# EAGLE design tappytap (EAGLE 7.3.0)
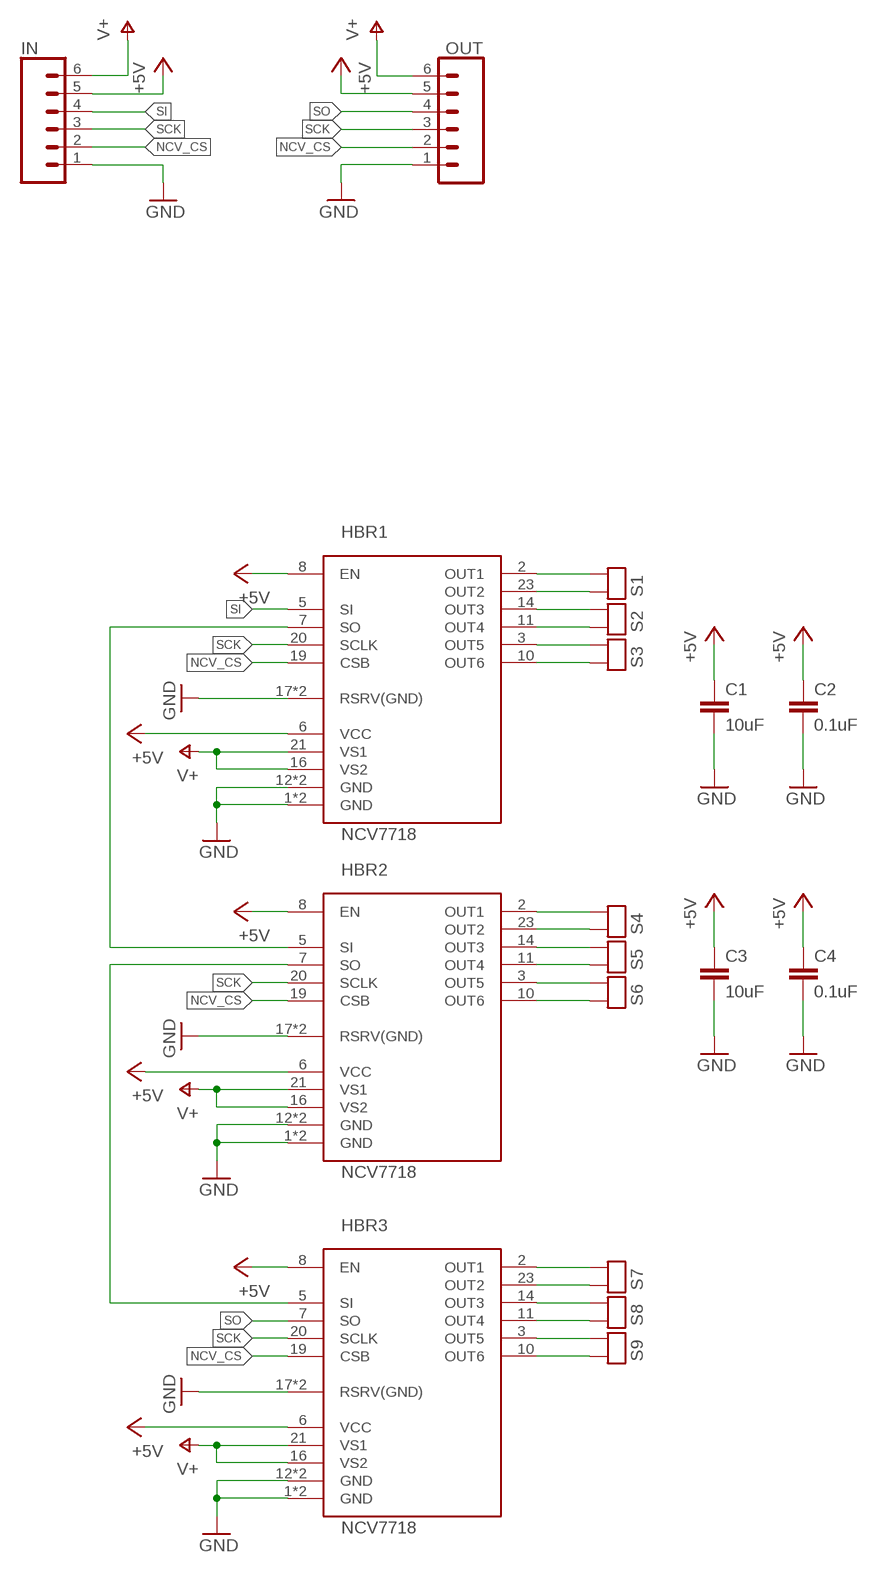
[diagram p0: schematic, sheet 1]

## Parts
C1  10uF  C-EUC0603  [C0603]
C2  0.1uF  C-EUC0603  [C0603]
C3  10uF  C-EUC0603  [C0603]
C4  0.1uF  C-EUC0603  [C0603]
HBR1  NCV7718  [SSOP-24]
HBR2  NCV7718  [SSOP-24]
HBR3  NCV7718  [SSOP-24]
IN  CONN_06SILK_FEMALE_PTH  [1X06]
OUT  CONN_06SILK_FEMALE_PTH  [1X06]
S1  TP2  [TP2_2MM]
S2  TP2  [TP2_2MM]
S3  TP2  [TP2_2MM]
S4  TP2  [TP2_2MM]
S5  TP2  [TP2_2MM]
S6  TP2  [TP2_2MM]
S7  TP2  [TP2_2MM]
S8  TP2  [TP2_2MM]
S9  TP2  [TP2_2MM]

## Nets
+5V [usbvcc]: C1.1 C2.1 C3.1 C4.1 HBR1.6(VCC) HBR1.8(EN) HBR2.6(VCC) HBR2.8(EN) HBR3.6(VCC) HBR3.8(EN) IN.5 OUT.5
GND [gnd]: C1.2 C2.2 C3.2 C4.2 HBR1.1(GND) HBR1.12(GND) HBR1.13(GND) HBR1.17(RSRV(GND)) HBR1.18(RSRV(GND)) HBR1.24(GND) HBR2.1(GND) HBR2.12(GND) HBR2.13(GND) HBR2.17(RSRV(GND)) HBR2.18(RSRV(GND)) HBR2.24(GND) HBR3.1(GND) HBR3.12(GND) HBR3.13(GND) HBR3.17(RSRV(GND)) HBR3.18(RSRV(GND)) HBR3.24(GND) IN.1 OUT.1
N$24: HBR1.7(SO) HBR2.5(SI)
N$26: HBR2.7(SO) HBR3.5(SI)
NCV_CS: HBR1.19(CSB) HBR2.19(CSB) HBR3.19(CSB) IN.2 OUT.2
S1A: HBR1.2(OUT1) S1.P$1
S1B: HBR1.23(OUT2) S1.P$2
S2A: HBR1.14(OUT3) S2.P$1
S2B: HBR1.11(OUT4) S2.P$2
S3A: HBR1.3(OUT5) S3.P$1
S3B: HBR1.10(OUT6) S3.P$2
S4A: HBR2.2(OUT1) S4.P$1
S4B: HBR2.23(OUT2) S4.P$2
S5A: HBR2.14(OUT3) S5.P$1
S5B: HBR2.11(OUT4) S5.P$2
S6A: HBR2.3(OUT5) S6.P$1
S6B: HBR2.10(OUT6) S6.P$2
S7A: HBR3.2(OUT1) S7.P$1
S7B: HBR3.23(OUT2) S7.P$2
S8A: HBR3.14(OUT3) S8.P$1
S8B: HBR3.11(OUT4) S8.P$2
S9A: HBR3.3(OUT5) S9.P$1
S9B: HBR3.10(OUT6) S9.P$2
SCK: HBR1.20(SCLK) HBR2.20(SCLK) HBR3.20(SCLK) IN.3 OUT.3
SI: HBR1.5(SI) IN.4
SO: HBR3.7(SO) OUT.4
V+: HBR1.16(VS2) HBR1.21(VS1) HBR2.16(VS2) HBR2.21(VS1) HBR3.16(VS2) HBR3.21(VS1) IN.6 OUT.6

## Library data of the parts
C1-C4 = rcl:C-EU: CAPACITOR, European symbol
HBR1-HBR3 = Sparky:NCV7718: Hex Half−Bridge Driver. The device can be operated in forward, reverse, brake, and high impedance states. The drivers are controlled via a 16 bit SPI interface and are daisy chain compatible.
IN OUT = SparkFun-Connectors:CONN_06: Multi connection point. Often used as Generic Header-pin footprint for 0.1 inch spaced/style header connections On any of the 0.1 inch spaced packages, you can populate with these: Break Away Headers - Straight <https://www.sparkfun.com/products/116> (PRT-00116) Break Away Male Headers - Right Angle <https://www.sparkfun.com/products/553> (PRT-00553) Female Headers <https://www.sparkfun.com/products/115> (PRT-00115) Break Away Headers - Machine Pin <https://www.sparkfun.com/products/117> (PRT-00117) Break Away Female Headers - Swiss Machine Pin <https://www.sparkfun.com/products/743> (PRT-00743) Arduino Stackable Header - 6 Pin <https://www.sparkfun.com/products/9280> (PRT-09280) For SCREWTERMINALS and SPRING TERMINALS visit here: Screw Terimnals on SparkFun.com <https://www.sparkfun.com/search/results?term=Screw+Terminals> (5mm/3.5mm/2.54mm spacing) This device is also useful as a general connection point to wire up your design to another part of your project. Our various solder wires solder well into these plated through hole pads. Hook-Up Wire - Assortment (Stranded, 22 AWG) <https://www.sparkfun.com/products/11375> (PRT-11375) Hook-Up Wire - Assortment (Solid Core, 22 AWG) <https://www.sparkfun.com/products/11367> (PRT-11367) View the entire wire category on our website here <https://www.sparkfun.com/categories/141>; PROD_ID: CONN-08437
S1-S9 = Sparky:TP2

## Board
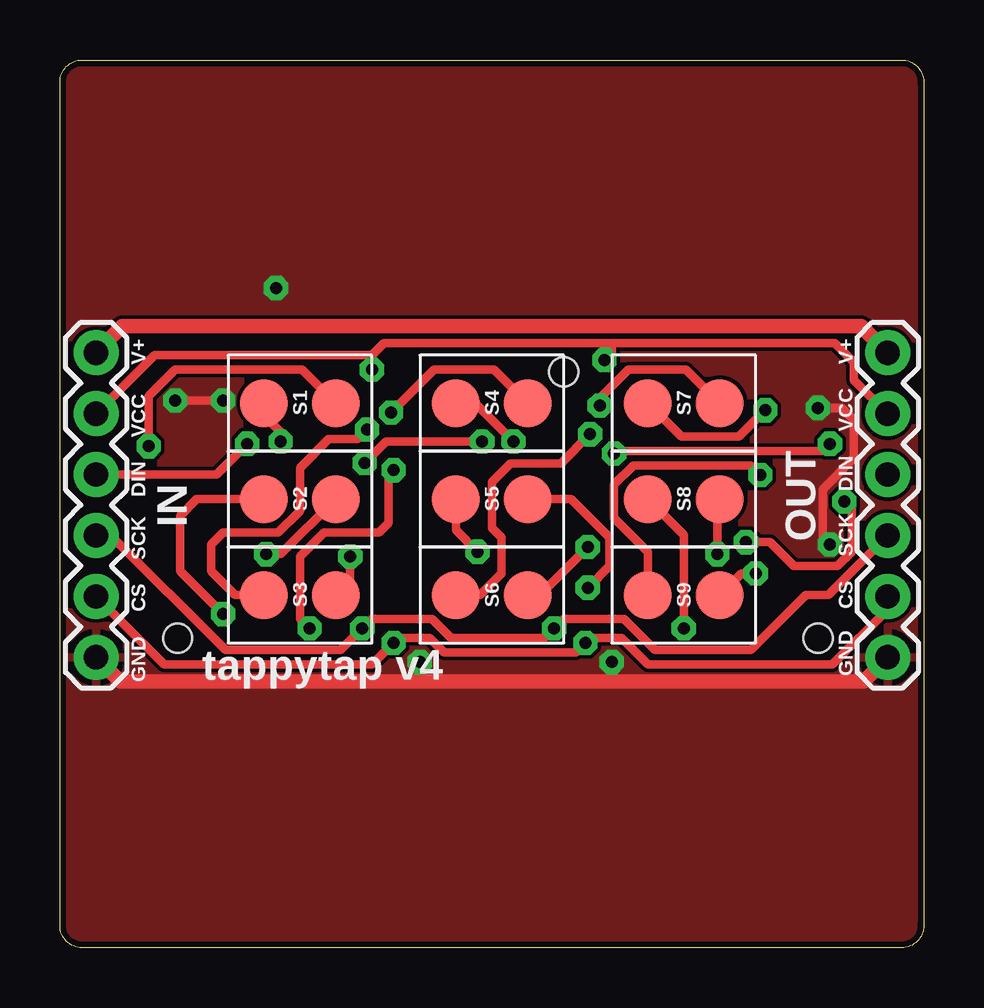
[diagram p1: board, top side]
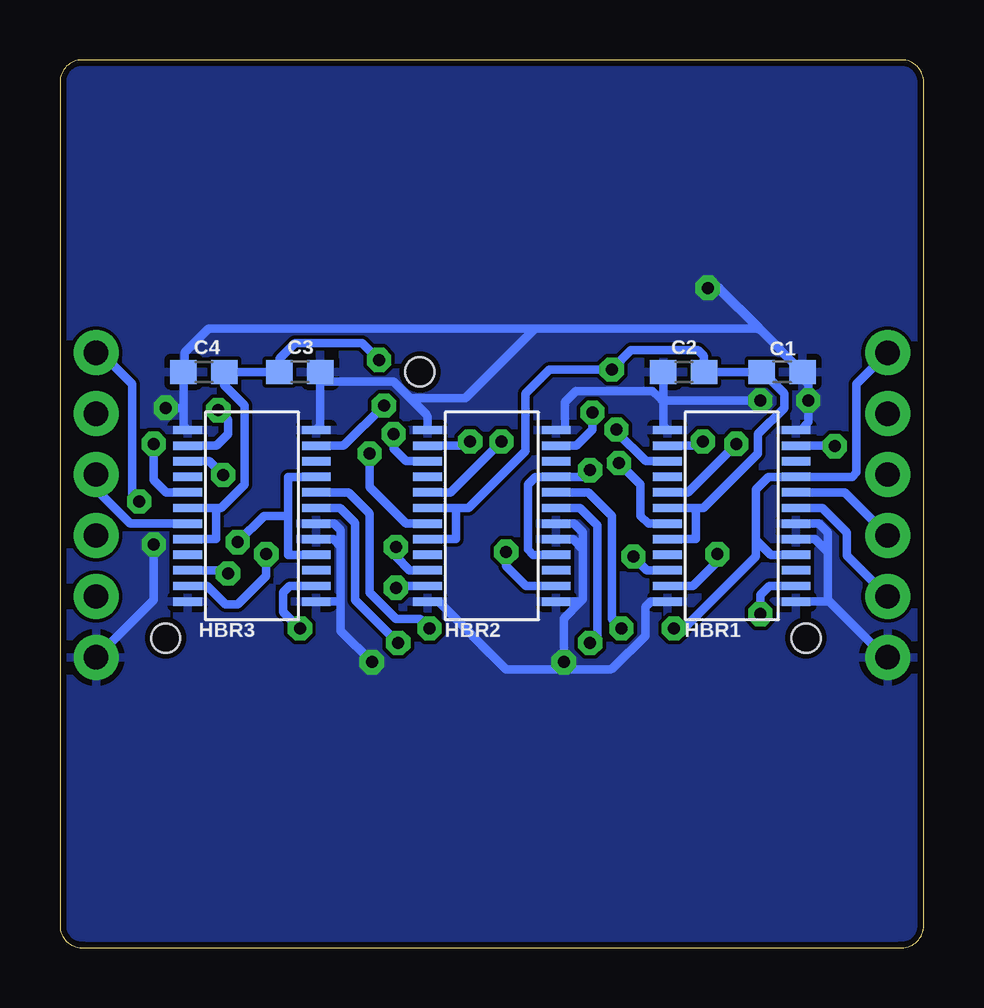
[diagram p2: board, bottom side, seen from below]

Size 36.01 x 37.01 mm. Coordinates in mm from the lower left corner, seen from the top.
Outline: 0,36 arc-100 1,37 35,37 arc-100 36,36 36,1 arc-100 35,0 1,0 arc-100 0,1 0,36
Copper layers (1*16): Top 0.035mm / dielectric 1.6mm / Bottom 0.035mm
Design rules "PCBWay": minimum track width 6mil, minimum drill 0.3mm, track to track 6mil, track to pad 6mil, pad to pad 6mil, via to via 6mil, smd to smd 6mil, copper to edge 10mil, drill to drill 8mil, minimum pad ring 12mil, minimum via ring 10mil, stop-mask expansion 4mil, vias tented up to drill 25mil, thermal gap 10mil
Holes 1.2 mm at 4.9,12.9 31.6,12.9 21,24

### Footprints (pad centres in the part's own frame; a part is rotated, then mirrored left to right if it is on the bottom)
C0603 = smd 1.1 x 1: 1 -0.85,0; 2 0.85,0
SSOP-24 = smd 1.2 x 0.35: 1 -2.68,3.575; 2 -2.68,2.925; 3 -2.68,2.275; 4 -2.68,1.625; 5 -2.68,0.975; 6 -2.68,0.325; 7 -2.68,-0.325; 8 -2.68,-0.975; 9 -2.68,-1.625; 10 -2.68,-2.275; 11 -2.68,-2.925; 12 -2.68,-3.575; 13 2.68,-3.575; 14 2.68,-2.925; 15 2.68,-2.275; 16 2.68,-1.625; 17 2.68,-0.975; 18 2.68,-0.325; 19 2.68,0.325; 20 2.68,0.975; 21 2.68,1.625; 22 2.68,2.275; 23 2.68,2.925; 24 2.68,3.575
1X06 = drill 1.016 pad 1.88: 1 0,0; 2 2.54,0; 3 5.08,0; 4 7.62,0; 5 10.16,0; 6 12.7,0
TP2_2MM = smd 2 x 2: P$1 -1.5,0; P$2 1.5,0

### Placement (x,y rotation side)
C1  5.9,24 0 bottom
C2  10,24 180 bottom
C3  26,24 0 bottom
C4  30,24 180 bottom
HBR1  8,18 0 bottom
HBR2  18,18 0 bottom
HBR3  28,18 0 bottom
IN  1.5,12.1 90 top
OUT  34.5,12.1 90 top
S1  10,22.7 0 top
S2  10,18.7 0 top
S3  10,14.7 0 top
S4  18,22.7 0 top
S5  18,18.7 0 top
S6  18,14.7 0 top
S7  26,22.7 0 top
S8  26,18.7 0 top
S9  26,14.7 0 top

### Tracks (layer width: path | path; a pad name or v marks a point on that pad's centre or on a via)
+5V  (via drill 0.5)
  Top 0.35: v13,24.1 13,24.7 | 13,24.7 3.94,24.7 IN.5 | OUT.5 33.1,23.66 33.1,24.4 32.3,25.2 23,25.2 | 13,24.7 13.5,25.2 23,25.2 | v22.7,24.5 23,24.8 23,25.2
  Bottom 0.35: 26.6,23.75 C3.1 | HBR1.6 9.5,18.33 | 9.5,18.33 9.18,18.33 6.9,20.6 6.9,21.4 5.8,22.5 5.8,23.1 6.65,23.95 6.7,23.95 C1.1 C2.1 9.15,24.65 9.4,24.9 12.2,24.9 v13,24.1 15.6,24.1 16.6,23.1 16.6,20.7 18.98,18.33 19.5,18.33 | HBR1.8 9.5,17.03 9.5,18.33 | HBR2.8 19.5,17.03 19.5,18.33 | 19.5,18.33 HBR2.6 | HBR3.6 29.5,18.33 | 29.5,18.33 29.5,17.03 HBR3.8 | 26.8,24.05 C3.1 | 29.5,18.33 29.28,18.33 28.3,19.3 28.3,22.6 29.15,23.45 C4.1 C3.1 | C3.1 26.85,24.55 26.2,25.2 23.4,25.2 v22.7,24.5
GND  (via drill 0.5)
  Top 0.35: v6.8,22.8 v4.8,22.8 | v15,11.9 15,11.1 | v23,11.9 23,11.1 | v32.1,16.8 31.8,17.1 31.8,19.1 33.1,20.4 33.1,22 32.6,22.5 v31.6,22.5
  Top 0.61: 34,11.6 OUT.1 33.5,11.1 23,11.1 15,11.1 2.5,11.1 IN.1
  Bottom 0.35: HBR1.13 4,14.43 4,14.5 | C2.2 10.85,23 | C3.2 25.15,23.5 | 24.3,14.43 HBR3.13 | HBR1.17 4.53,17.03 4,16.5 | HBR3.17 24.63,17.03 24.3,16.7 | 24.3,16.7 24.3,14.43 | 11,22.9 10.95,22.9 10.85,23 | 14.2,16.6 14.63,17.03 HBR2.17 | 14.2,16.6 14.2,14.53 14.3,14.43 | HBR2.13 14.3,14.43 | v15,11.9 14.7,11.6 17.4,11.6 20.23,14.43 HBR2.12 | 14.3,14.43 15,13.73 v15,11.9 | 24.3,14.43 24.3,13.2 v23,11.9 | 21.4,22.9 22.1,23.6 25.05,23.6 25.15,23.5 | 21.4,22.9 19.1,22.9 16.2,25.8 | HBR1.24 5.13,21.58 4.8,21.9 v4.8,22.8 4.8,23.5 5.2,23.9 | v6.8,22.8 10.9,22.8 11,22.9 | 5.05,24.15 C1.2 6.85,25.8 16.2,25.8 | 10.85,23 10.85,21.75 10.7,21.6 | 25.15,23.5 25.15,21.75 HBR3.24 | HBR1.12 11.38,14.43 11.6,14.2 11.6,13 12.93,11.68 arc45 13.11,11.6 14.6,11.6 arc45 14.77,11.67 v15,11.9 | 15.28,17.68 HBR2.18 14.58,17.68 14.2,17.3 14.2,16.6 | 30.85,22.5 C4.2 30.95,24.1 | 30.85,22.5 30.85,21.85 arc-45 30.78,21.67 HBR3.1 | HBR2.24 15.13,21.58 arc-45 14.95,21.65 14.95,22.75 14.5,23.2 11.3,23.2 11,22.9 | HBR2.1 20.68,22.08 arc-45 20.76,22.26 21.4,22.9 | HBR1.18 4.38,17.68 4,17.3 4,16.5 | HBR3.18 24.58,17.68 24.3,17.4 24.3,16.7 | IN.1 1.6,12.1 4,14.5 | 4,14.5 4,16.5 | 16.2,25.8 29.8,25.8 30.8,24.8 30.8,23.8 | OUT.1 32.1,14.5 v32.1,16.8 | v31.6,22.5 30.85,22.5
  Bottom 0.406: 6.85,25.8 8.55,27.5 v9,27.5
  pour Bottom: 0,36 arc-100 1,37 35,37 arc-100 36,36 36,1 arc-100 35,0 1,0 arc-100 0,1
  pour Top: 0,36 arc-100 1,37 35,37 arc-100 36,36 36,1 arc-100 35,0 1,0 arc-100 0,1
N$24  (via drill 0.5)
  Top 0.35: v12.7,20.2 13.6,21.1 v17.6,21.1
  Bottom 0.35: HBR1.7 11.48,17.68 11.8,18 11.8,19.3 v12.7,20.2 | HBR2.5 19.73,18.98 v17.6,21.1
N$26  (via drill 0.5)
  Top 0.35: v23.1,20.6 23.2,20.7 31.8,20.7 v32.1,21
  Bottom 0.35: HBR2.7 21.58,17.68 23.1,19.2 v23.1,20.6 | HBR3.5 31.58,18.98 32.1,19.5 v32.1,21
NCV_CS  (via drill 0.5)
  Top 0.35: OUT.2 34.5,14.1 32.2,11.8 24.5,11.8 23.4,12.9 22.1,12.9 v21.9,12.7 21.5,12.3 16,12.3 15.4,12.9 14.1,12.9 v13.9,12.7 13,11.8 4.34,11.8 IN.2
  Bottom 0.35: HBR2.19 14.33,18.33 13.6,17.6 13.6,13 v13.9,12.7 | v21.9,12.7 23.7,14.5 23.7,17.7 24.33,18.33 HBR3.19 | HBR1.19 4.23,18.33 3.2,17.3 3.2,16.34 IN.2
S1A  (via drill 0.5)
  Top 0.35: S1.P$1 8,22.7 9.2,21.5 v9.2,21.1
  Bottom 0.35: HBR1.2 9.38,20.93 v9.2,21.1
S1B  (via drill 0.5)
  Top 0.35: S1.P$2 10.1,24.1 4.8,24.1 3.7,23 v3.7,20.9
  Bottom 0.35: HBR1.23 3.73,20.93 v3.7,20.9
S2A  (via drill 0.5)
  Top 0.35: S2.P$1 5.7,18.7 5,18 5,15.7 v6.8,13.9
  Bottom 0.35: HBR1.14 6.43,15.08 6.8,14.7 v6.8,13.9
S2B  (via drill 0.5)
  Top 0.35: S2.P$2 9.2,16.4 v8.6,16.4
  Bottom 0.35: HBR1.11 9.63,15.08 8.6,16.1 v8.6,16.4
S3A  (via drill 0.5)
  Top 0.35: S3.P$1 7.3,14.7 6.3,15.7 6.3,16.8 6.8,17.3 9.1,17.3 10,18.2 10,20 11.2,21.2 12.4,21.2 v12.8,21.6
  Bottom 0.35: HBR1.3 11.58,20.28 12.8,21.5 v12.8,21.6
S3B  (via drill 0.5)
  Top 0.35: S3.P$2 12.1,15.3 v12.1,16.3
  Bottom 0.35: HBR1.10 11.53,15.73 v12.1,16.3
S4A  (via drill 0.5)
  Top 0.35: S4.P$1 17.3,22.7 v18.9,21.1
  Bottom 0.35: HBR2.2 19.08,20.93 v18.9,21.1
S4B  (via drill 0.5)
  Top 0.35: S4.P$2 18.1,24.1 15.6,24.1 v13.8,22.3
  Bottom 0.35: HBR2.23 14.48,20.93 13.8,21.6 v13.8,22.3
S5A  (via drill 0.5)
  Top 0.35: S5.P$1 16.5,17.4 v17.4,16.5
  Bottom 0.35: v17.4,16.5 17.4,15.9 16.58,15.08 HBR2.14
S5B  (via drill 0.5)
  Top 0.35: S5.P$2 21.3,18.7 22.9,17.1 22.9,15.9 v22,15
  Bottom 0.35: v22,15 21.93,15.08 HBR2.11
S6A  (via drill 0.5)
  Top 0.35: S6.P$1 17.5,14.7 18.4,15.6 18.4,17.1 18,17.5 18,19.4 18.78,20.18 20.88,20.18 v22.1,21.4
  Bottom 0.35: HBR2.3 21.58,20.28 22.1,20.8 v22.1,21.4
S6B  (via drill 0.5)
  Top 0.35: S6.P$2 20,14.7 v22,16.7
  Bottom 0.35: v22,16.7 22,16.3 21.43,15.73 HBR2.10
S7A  (via drill 0.5)
  Top 0.35: S7.P$1 25.9,21.3 28.3,21.3 v29.4,22.4
  Bottom 0.35: v29.4,22.4 29,22 29,21.4 29.48,20.93 HBR3.2
S7B  (via drill 0.5)
  Top 0.35: v22.5,22.6 22.5,22.9 23.7,24.1 26.1,24.1 S7.P$2
  Bottom 0.35: HBR3.23 24.18,20.93 v22.5,22.6
S8A  (via drill 0.5)
  Top 0.35: S8.P$1 26,17.2 v26,13.3
  Bottom 0.35: HBR3.14 26.43,15.08 26.7,14.8 26.7,14 v26,13.3
S8B  (via drill 0.5)
  Top 0.35: S8.P$2 27.4,18.6 v27.4,16.4
  Bottom 0.35: HBR3.11 29.88,15.08 29.1,14.3 28.6,14.3 27.4,15.5 v27.4,16.4
S9A  (via drill 0.5)
  Top 0.35: v29.2,19.7 28.8,20.1 23.9,20.1 23.1,19.3 23.1,17.9 24.5,16.5 S9.P$1
  Bottom 0.35: HBR3.3 29.78,20.28 v29.2,19.7
S9B  (via drill 0.5)
  Top 0.35: S9.P$2 28.4,15.6 v29,15.6
  Bottom 0.35: HBR3.10 29.13,15.73 v29,15.6
SCK  (via drill 0.5)
  Top 0.35: OUT.3 32.02,14.7 31.1,14.7 28.8,12.4 24.8,12.4 23.5,13.7 21,13.7 v20.6,13.3 20.2,12.9 16.3,12.9 15.5,13.7 13,13.7 v12.6,13.3 11.7,12.4 6.9,12.4 2.12,17.18 IN.3
  Bottom 0.35: v12.6,13.3 13,13.7 13,18 13.98,18.98 HBR2.20 | v20.6,13.3 21,13.7 22,13.7 23.1,14.8 23.1,18.1 23.98,18.98 HBR3.20 | HBR1.20 3.3,18.98 IN.3
SI  (via drill 0.5)
  Top 0.35: IN.4 6.52,19.72 v7.8,21
  Bottom 0.35: v7.8,21 9.83,18.98 HBR1.5
SO
  Bottom 0.35: HBR3.7 33.08,17.68 34.5,19.1 OUT.4
V+  (via drill 0.5)
  Top 0.35: v10.4,13.3 10,13.7 10,16.3 11,17.3 13.3,17.3 13.7,17.7 13.7,19.7 v13.9,19.9 | v28.6,16.9 29.6,16.9 30.6,15.9 32.4,15.9 33,16.5 33,18.3 v32.7,18.6
  Top 0.61: IN.6 2.6,25.9 33.4,25.9 OUT.6 33.6,25.7
  Bottom 0.35: 7,17 7,19.1 6.48,19.63 HBR1.21 2.98,19.63 2.8,19.8 2.8,23.5 IN.6 | 7,17 6.38,16.38 HBR1.16 | HBR2.16 16.28,16.38 16.5,16.6 16.5,19.3 16.18,19.63 HBR2.21 14.18,19.63 v13.9,19.9 | HBR3.16 26.5,16.38 26.5,18.01 | 7,17 7,16.3 10,13.3 v10.4,13.3 | 26.5,18.01 26.5,19.63 HBR3.21 | 26.5,18.01 27.5,18.01 v28.6,16.9 | OUT.6 34.3,24.8 33,23.5 33,18.9 v32.7,18.6

### Text on the board
tNames: V+ | V+ | VCC | VCC | DIN | DIN | SCK | SCK | CS | CS | GND | tappytap v4 | GND